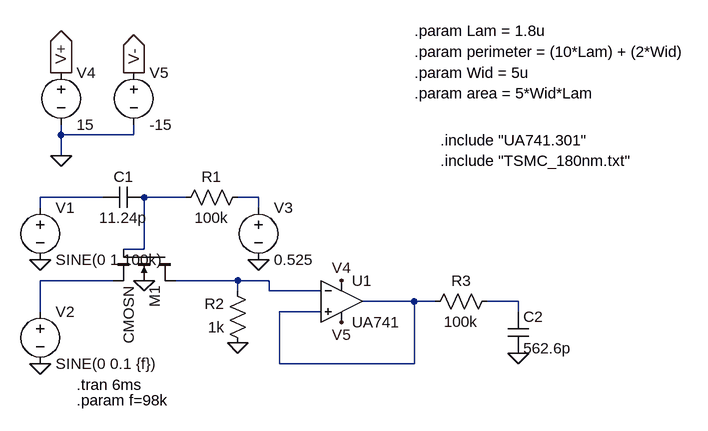
[diagram p0: schematic mixer.asc]
mixer.asc, the LTspice schematic file:
Version 4
SHEET 1 1580 1544
WIRE -32 -1120 -32 -1136
WIRE 80 -1120 80 -1136
WIRE 80 -1120 -32 -1120
WIRE -32 -1088 -32 -1120
WIRE 32 -1024 -64 -1024
WIRE 160 -1024 96 -1024
WIRE 272 -1024 240 -1024
WIRE -64 -1008 -64 -1024
WIRE 272 -1008 272 -1024
WIRE 96 -944 96 -1024
WIRE 96 -944 64 -944
WIRE 48 -896 -64 -896
WIRE 240 -896 144 -896
WIRE 288 -896 240 -896
WIRE 240 -880 240 -896
WIRE 288 -880 288 -896
WIRE 368 -880 288 -880
WIRE 512 -864 432 -864
WIRE 544 -864 512 -864
WIRE 672 -864 624 -864
WIRE -64 -848 -64 -896
WIRE 368 -848 304 -848
WIRE 672 -848 672 -864
WIRE 304 -768 304 -848
WIRE 512 -768 512 -864
WIRE 512 -768 304 -768
FLAG 96 -896 0
FLAG 240 -800 0
FLAG -64 -768 0
FLAG -64 -928 0
FLAG 272 -928 0
FLAG 672 -784 0
FLAG -32 -1088 0
FLAG -32 -1216 V+
IOPIN -32 -1216 Out
FLAG 80 -1216 V-
IOPIN 80 -1216 Out
FLAG 400 -896 V4
FLAG 400 -832 V5
SYMBOL nmos4 144 -944 R90
SYMATTR InstName M1
SYMATTR Value CMOSN
SYMATTR Value2 l=0.18u w=1.8u ad=0.81p as=0.81p pd=4.5u ps=4.5u
SYMBOL res 256 -1040 R90
WINDOW 0 0 56 VBottom 2
WINDOW 3 32 56 VTop 2
SYMATTR InstName R1
SYMATTR Value 100k
SYMBOL res 256 -784 R180
WINDOW 0 36 76 Left 2
WINDOW 3 36 40 Left 2
SYMATTR InstName R2
SYMATTR Value 1k
SYMBOL cap 96 -1040 R90
WINDOW 0 0 32 VBottom 2
WINDOW 3 32 32 VTop 2
SYMATTR InstName C1
SYMATTR Value 11.24p
SYMBOL voltage -64 -1024 R0
WINDOW 123 0 0 Left 0
WINDOW 39 0 0 Left 0
SYMATTR InstName V1
SYMATTR Value SINE(0 1 100k)
SYMBOL voltage -64 -864 R0
WINDOW 123 0 0 Left 0
WINDOW 39 0 0 Left 0
SYMATTR InstName V2
SYMATTR Value SINE(0 0.1 {f})
SYMBOL voltage 272 -1024 R0
WINDOW 123 0 0 Left 0
WINDOW 39 0 0 Left 0
SYMATTR InstName V3
SYMATTR Value 0.525
SYMBOL res 640 -880 R90
WINDOW 0 0 56 VBottom 2
WINDOW 3 32 56 VTop 2
SYMATTR InstName R3
SYMATTR Value 100k
SYMBOL cap 656 -848 R0
SYMATTR InstName C2
SYMATTR Value 562.6p
SYMBOL OpAmps\\opamp2 400 -928 R0
SYMATTR InstName U1
SYMATTR Value UA741
SYMBOL voltage -32 -1232 R0
WINDOW 123 0 0 Left 0
WINDOW 39 0 0 Left 0
SYMATTR InstName V4
SYMATTR Value 15
SYMBOL voltage 80 -1232 R0
WINDOW 123 0 0 Left 0
WINDOW 39 0 0 Left 0
SYMATTR InstName V5
SYMATTR Value -15
TEXT -8 -736 Left 2 !.tran 6ms
TEXT -8 -712 Left 2 !.param f=98k
TEXT 552 -1112 Left 2 !.include "UA741.301"
TEXT 552 -1080 Left 2 !.include "TSMC_180nm.txt"
TEXT 512 -1248 Left 2 !.param perimeter = (10*Lam) + (2*Wid)
TEXT 512 -1280 Left 2 !.param Lam = 1.8u
TEXT 512 -1216 Left 2 !.param Wid = 5u
TEXT 512 -1184 Left 2 !.param area = 5*Wid*Lam

The netlist it stands for:
* mixer.asc
M1 N005 N002 N004 0 CMOSN l=0.18u w=1.8u ad=0.81p as=0.81p pd=4.5u ps=4.5u
R1 N003 N002 100k
R2 0 N005 1k
C1 N002 N001 11.24p
V1 N001 0 SINE(0 1 100k)
V2 N004 0 SINE(0 0.1 {f})
V3 N003 0 0.525
R3 N007 N006 100k
C2 N007 0 562.6p
XU1 N006 N005 V4 V5 N006 UA741  ; pins In+ In- V+ V- OUT
V4 V+ 0 15
V5 V- 0 -15
.model NMOS NMOS
.model PMOS PMOS
.lib standard.mos
.tran 6ms
.param f=98k
.include "UA741.301"
.include "TSMC_180nm.txt"
.param perimeter = (10*Lam) + (2*Wid)
.param Lam = 1.8u
.param Wid = 5u
.param area = 5*Wid*Lam
.backanno
.end